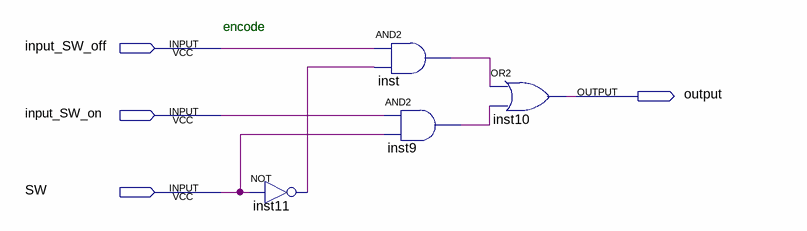
[diagram p0: schematic sheet]
// Quartus schematic selector.bdf as structural Verilog: 4 symbols, 4 pins
module selector (
  input  input_SW_off,
  input  input_SW_on,
  input  SW,
  output \output 
);

  wire inst9_out, inst11_out, inst_out;

  not inst11 (inst11_out, SW);
  and inst (inst_out, input_SW_off, inst11_out);
  and inst9 (inst9_out, input_SW_on, SW);
  or inst10 (\output , inst_out, inst9_out);

  // Other names for the same wires on the sheet: encode = input_SW_off

  // Notes on the sheet:
  //   encode
endmodule
